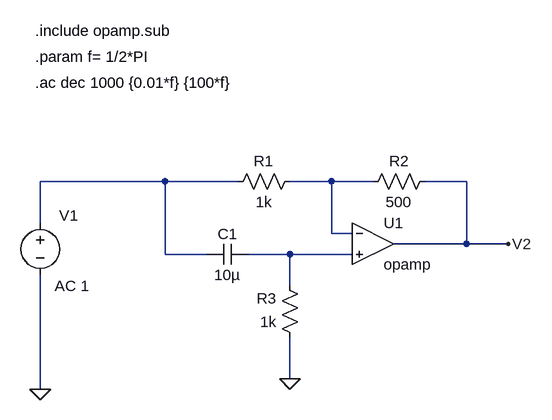
[diagram p0: schematic TS1_LTSpice.asc]
TS1_LTSpice.asc, the LTspice schematic file:
Version 4
SHEET 1 880 680
WIRE -224 -64 -416 -64
WIRE -112 -64 -224 -64
WIRE 32 -64 -32 -64
WIRE 96 -64 32 -64
WIRE 240 -64 176 -64
WIRE -416 0 -416 -64
WIRE 32 16 32 -64
WIRE 64 16 32 16
WIRE 240 32 240 -64
WIRE 240 32 128 32
WIRE 304 32 240 32
WIRE -224 48 -224 -64
WIRE -160 48 -224 48
WIRE -32 48 -96 48
WIRE 64 48 -32 48
WIRE -32 96 -32 48
WIRE -32 240 -32 176
WIRE -416 256 -416 80
FLAG -32 240 0
FLAG -416 256 0
FLAG 304 32 V2
SYMBOL Opamps\\opamp 96 -32 R0
SYMATTR InstName U1
SYMBOL res -16 -80 R90
WINDOW 0 0 56 VBottom 2
WINDOW 3 32 56 VTop 2
SYMATTR InstName R1
SYMATTR Value 1k
SYMBOL res 192 -80 R90
WINDOW 0 0 56 VBottom 2
WINDOW 3 32 56 VTop 2
SYMATTR InstName R2
SYMATTR Value 500
SYMBOL res -16 192 R180
WINDOW 0 36 76 Left 2
WINDOW 3 36 40 Left 2
SYMATTR InstName R3
SYMATTR Value 1k
SYMBOL cap -96 32 R90
WINDOW 0 0 32 VBottom 2
WINDOW 3 32 32 VTop 2
SYMATTR InstName C1
SYMATTR Value 10µ
SYMBOL voltage -416 -16 R0
WINDOW 3 -313 165 Left 2
WINDOW 123 22 113 Left 2
WINDOW 39 0 0 Left 0
WINDOW 0 29 4 Left 2
SYMATTR Value ""
SYMATTR Value2 AC 1
SYMATTR InstName V1
TEXT -424 -216 Left 2 !.ac dec 1000 {0.01*f} {100*f}
TEXT -424 -296 Left 2 !.include opamp.sub
TEXT -424 -256 Left 2 !.param f= 1/2*PI

The netlist it stands for:
* TS1_LTSpice.asc
XU1 N002 N003 V2 opamp Aol=100K GBW=10Meg  ; pins invin noninvin out
R1 N002 N001 1k
R2 V2 N002 500
R3 0 N003 1k
C1 N003 N001 10µ
V1 N001 0 AC 1
.ac dec 1000 {0.01*f} {100*f}
.include opamp.sub
.param f= 1/2*PI
.backanno
.end

* Results of the author's LTspice run, read from the files saved beside the schematic
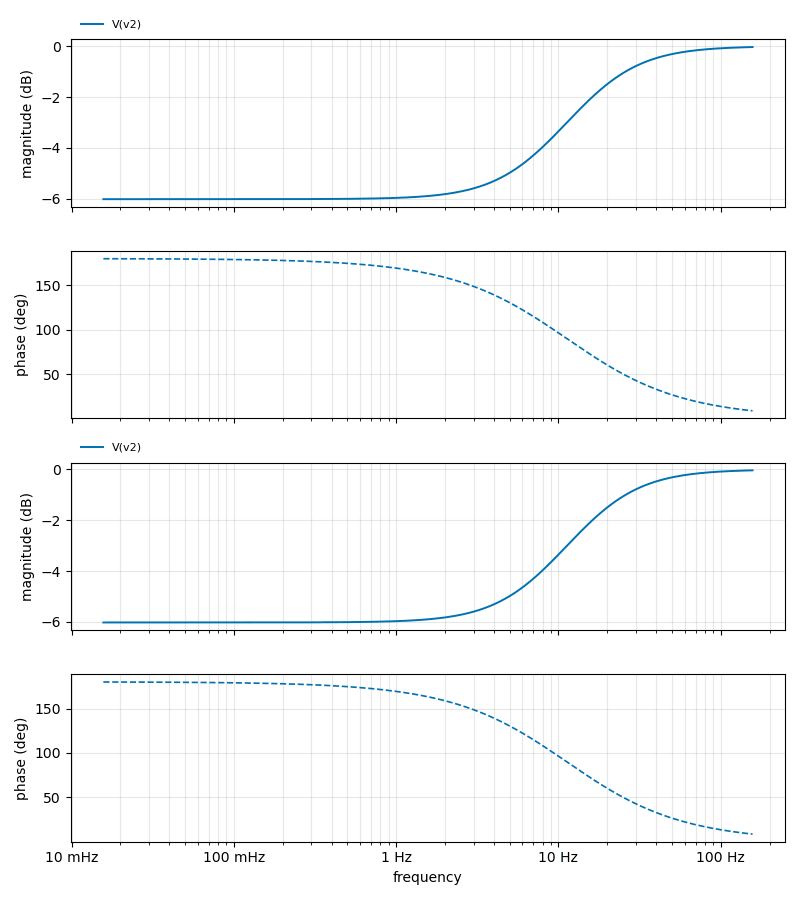
[diagram p1: AC Analysis of TS1_LTSpice.asc, plotted from the saved traces]
* AC Analysis, 1 run:
*   V(v2): -6.02 dB at 15.71 mHz, -0.03 dB at 157.1 Hz, peak -0.03 dB at 157.1 Hz, 3 dB below the peak at 11.13 Hz
*   V(v2): -6.02 dB at 15.71 mHz, -0.03 dB at 157.1 Hz, peak -0.03 dB at 157.1 Hz, 3 dB below the peak at 11.13 Hz